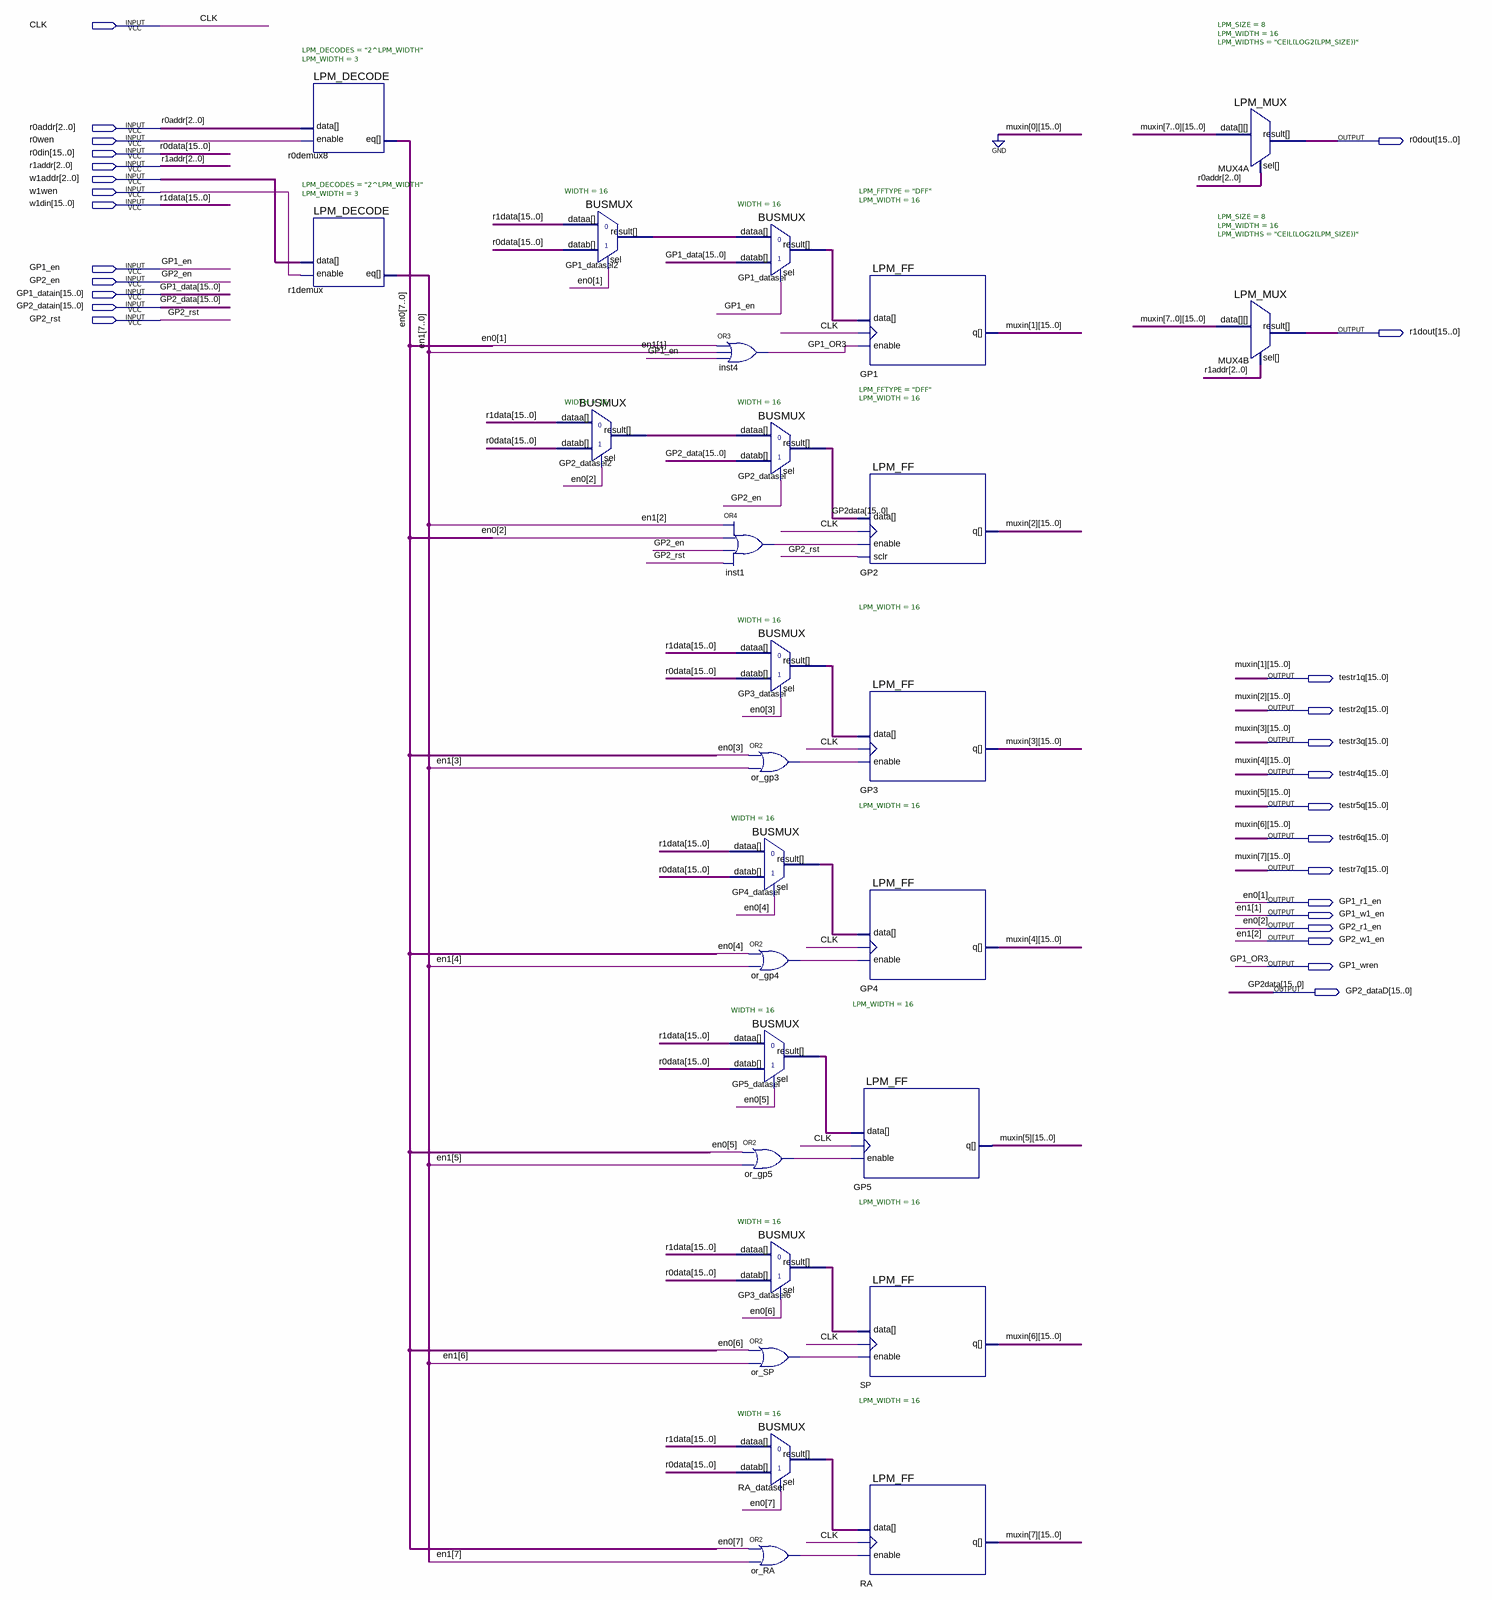
[diagram p0: schematic sheet]
// Quartus schematic regfile_8_twoport_3.bdf as structural Verilog: 27 symbols, 28 pins
module regfile_8_twoport_3 (
  input  CLK,
  input  [2:0] r0addr,
  input  r0wen,
  input  [15:0] r0din,
  input  [2:0] r1addr,
  input  [2:0] w1addr,
  input  w1wen,
  input  [15:0] w1din,
  input  GP1_en,
  input  GP2_en,
  input  [15:0] GP1_datain,
  input  [15:0] GP2_datain,
  input  GP2_rst,
  output [15:0] r0dout,
  output [15:0] r1dout,
  output [15:0] testr1q,
  output [15:0] testr2q,
  output [15:0] testr3q,
  output [15:0] testr4q,
  output [15:0] testr5q,
  output [15:0] testr6q,
  output [15:0] testr7q,
  output GP1_r1_en,
  output GP1_w1_en,
  output GP2_r1_en,
  output GP2_w1_en,
  output GP1_wren,
  output [15:0] GP2_dataD
);

  wire inst1_out, or_gp3_out, or_gp4_out, or_gp5_out, or_RA_out, or_SP_out;
  wire [7:0] en0, en1;
  wire [15:0] GP1_datasel2_result, GP1_datasel_result, GP2_datasel2_result, GP3_datasel6_result,
       GP3_datasel_result, GP4_datasel_result, GP5_datasel_result, RA_datasel_result;

  LPM_DECODE #(.LPM_DECODES("2^LPM_WIDTH"), .LPM_WIDTH(3)) r0demux8 (
    .data(r0addr), .enable(r0wen), .eq({en0[7:3], GP2_r1_en, GP1_r1_en, en0[0]}));
  LPM_DECODE #(.LPM_DECODES("2^LPM_WIDTH"), .LPM_WIDTH(3)) r1demux (
    .data(w1addr), .enable(w1wen), .eq({en1[7:3], GP2_w1_en, GP1_w1_en, en1[0]}));
  BUSMUX #(.WIDTH(16)) GP2_datasel2 (.datab(r0din), .sel(GP2_r1_en), .dataa(w1din), .result(GP2_datasel2_result));
  BUSMUX #(.WIDTH(16)) GP1_datasel2 (.datab(r0din), .sel(GP1_r1_en), .dataa(w1din), .result(GP1_datasel2_result));
  BUSMUX #(.WIDTH(16)) GP1_datasel (
    .datab(GP1_datain), .sel(GP1_en), .dataa(GP1_datasel2_result), .result(GP1_datasel_result));
  or inst4 (GP1_wren, GP1_r1_en, GP1_w1_en, GP1_en);
  BUSMUX #(.WIDTH(16)) GP2_datasel (.datab(GP2_datain), .sel(GP2_en), .dataa(GP2_datasel2_result), .result(GP2_dataD));
  or inst1 (inst1_out, GP2_w1_en, GP2_r1_en, GP2_en, GP2_rst);
  BUSMUX #(.WIDTH(16)) GP3_datasel (.datab(r0din), .sel(en0[3]), .dataa(w1din), .result(GP3_datasel_result));
  or or_gp3 (or_gp3_out, en0[3], en1[3]);
  BUSMUX #(.WIDTH(16)) GP4_datasel (.datab(r0din), .sel(en0[4]), .dataa(w1din), .result(GP4_datasel_result));
  or or_gp4 (or_gp4_out, en0[4], en1[4]);
  BUSMUX #(.WIDTH(16)) GP5_datasel (.datab(r0din), .sel(en0[5]), .dataa(w1din), .result(GP5_datasel_result));
  or or_gp5 (or_gp5_out, en0[5], en1[5]);
  BUSMUX #(.WIDTH(16)) GP3_datasel6 (.datab(r0din), .sel(en0[6]), .dataa(w1din), .result(GP3_datasel6_result));
  or or_SP (or_SP_out, en0[6], en1[6]);
  BUSMUX #(.WIDTH(16)) RA_datasel (.datab(r0din), .sel(en0[7]), .dataa(w1din), .result(RA_datasel_result));
  or or_RA (or_RA_out, en0[7], en1[7]);
  LPM_FF #(.LPM_FFTYPE("DFF"), .LPM_WIDTH(16)) GP1 (
    .clock(CLK), .data(GP1_datasel_result), .enable(GP1_wren), .q(testr1q));
  LPM_FF #(.LPM_FFTYPE("DFF"), .LPM_WIDTH(16)) GP2 (
    .clock(CLK), .data(GP2_dataD), .enable(inst1_out), .sclr(GP2_rst), .q(testr2q));
  LPM_FF #(.LPM_WIDTH(16)) GP3 (.clock(CLK), .data(GP3_datasel_result), .enable(or_gp3_out), .q(testr3q));
  LPM_FF #(.LPM_WIDTH(16)) GP4 (.clock(CLK), .data(GP4_datasel_result), .enable(or_gp4_out), .q(testr4q));
  LPM_FF #(.LPM_WIDTH(16)) GP5 (.clock(CLK), .data(GP5_datasel_result), .enable(or_gp5_out), .q(testr5q));
  LPM_FF #(.LPM_WIDTH(16)) SP (.clock(CLK), .data(GP3_datasel6_result), .enable(or_SP_out), .q(testr6q));
  LPM_FF #(.LPM_WIDTH(16)) RA (.clock(CLK), .data(RA_datasel_result), .enable(or_RA_out), .q(testr7q));
  LPM_MUX #(.LPM_SIZE(8), .LPM_WIDTH(16), .LPM_WIDTHS("CEIL(LOG2(LPM_SIZE))")) MUX4A (
    .data({testr7q, testr6q, testr5q, testr4q, testr3q, testr2q, testr1q, {16{1'b0}}}), .sel(r0addr),
    .result(r0dout));
  LPM_MUX #(.LPM_SIZE(8), .LPM_WIDTH(16), .LPM_WIDTHS("CEIL(LOG2(LPM_SIZE))")) MUX4B (
    .data({testr7q, testr6q, testr5q, testr4q, testr3q, testr2q, testr1q, {16{1'b0}}}), .sel(r1addr),
    .result(r1dout));

  // Other names for the same wires on the sheet: en0[2:1] = {GP2_r1_en, GP1_r1_en}; en1[2:1] = {GP2_w1_en, GP1_w1_en};
  //   GP1_data[15:0] = GP1_datain; GP1_OR3 = GP1_wren; GP2_data[15:0] = GP2_datain; GP2data[15:0] = GP2_dataD;
  //   muxin_1[15:0] = testr1q; muxin_2[15:0] = testr2q; muxin_3[15:0] = testr3q; muxin_4[15:0] = testr4q;
  //   muxin_5[15:0] = testr5q; muxin_6[15:0] = testr6q; muxin_7[15:0] = testr7q; r0data[15:0] = r0din;
  //   r1data[15:0] = w1din
endmodule
